# Altium schematic sheet nusense-controller.schdoc: NUSense
size A4; Organization: Elby Designs; Address1: 9 Follan Close; Address2: Kariong; Address3: NSW 2250; Address4: Australia; Revision: 1; SheetNumber: 1; SheetTotal: 9; DrawnBy: Controller Section; Engineer: Laurie Biddulph; PageSetup: Record=PageOptions|CenterHorizontal=True|CenterVertical=True|PrintScale=1.38|XCorrection=1.00|YCorrection=1.00|PrintKind=1|BorderSize=5000000|LeftOffset=0|BottomOffset=0|Orientation=2|PaperLength=1000|PaperWidth=1000|Scale=100|PaperSource=7|PrintQuality=-4|MediaType=1|DitherType=10|PaperKind=A3|PrintScaleMode=1
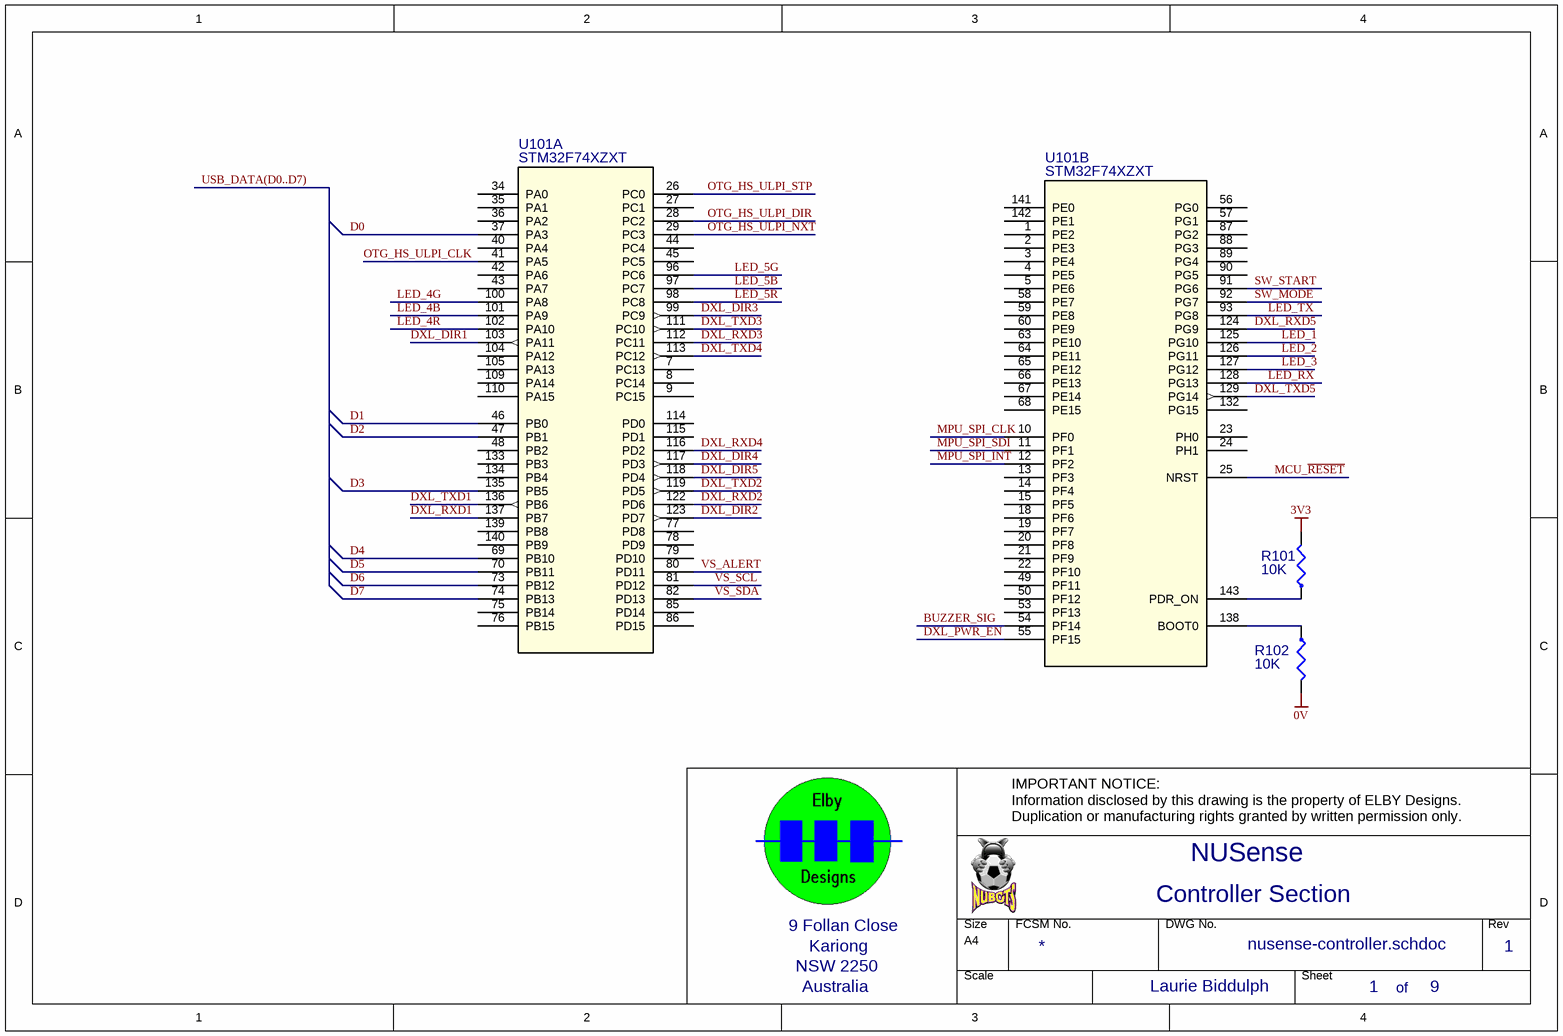
[diagram p0: nusense-controller.schdoc]

## Parts
R101  10K  [AXIAL-0.4(LB)]
R102  10K  [AXIAL-0.4(LB)]
U101  STM32F74XZXT  [LQFP-144_20X20mm]  (parts A,B of 3)

## Nets
0V: R102.2
3V3: R101.2
BUZZER_SIG: U101.54(PF14)
D0: U101.37(PA3)
D1: U101.46(PB0)
D2: U101.47(PB1)
D3: U101.135(PB5)
D4: U101.69(PB10)
D5: U101.70(PB11)
D6: U101.73(PB12)
D7: U101.74(PB13)
DXL_DIR1: U101.103(PA11)
DXL_DIR2: U101.123(PD7)
DXL_DIR3: U101.99(PC9)
DXL_DIR4: U101.117(PD3)
DXL_DIR5: U101.118(PD4)
DXL_PWR_EN: U101.55(PF15)
DXL_RXD1: U101.137(PB7)
DXL_RXD2: U101.122(PD6)
DXL_RXD3: U101.112(PC11)
DXL_RXD4: U101.116(PD2)
DXL_RXD5: U101.124(PG9)
DXL_TXD1: U101.136(PB6)
DXL_TXD2: U101.119(PD5)
DXL_TXD3: U101.111(PC10)
DXL_TXD4: U101.113(PC12)
DXL_TXD5: U101.129(PG14)
LED_1: U101.125(PG10)
LED_2: U101.126(PG11)
LED_3: U101.127(PG12)
LED_4B: U101.101(PA9)
LED_4G: U101.100(PA8)
LED_4R: U101.102(PA10)
LED_5B: U101.97(PC7)
LED_5G: U101.96(PC6)
LED_5R: U101.98(PC8)
LED_RX: U101.128(PG13)
LED_TX: U101.93(PG8)
MCU_~{RESET}: U101.25(NRST)
MPU_SPI_CLK: U101.10(PF0)
MPU_SPI_INT: U101.12(PF2)
MPU_SPI_SDI: U101.11(PF1)
OTG_HS_ULPI_CLK: U101.41(PA5)
OTG_HS_ULPI_DIR: U101.28(PC2)
OTG_HS_ULPI_NXT: U101.29(PC3)
OTG_HS_ULPI_STP: U101.26(PC0)
SW_MODE: U101.92(PG7)
SW_START: U101.91(PG6)
VS_ALERT: U101.80(PD11)
VS_SCL: U101.81(PD12)
VS_SDA: U101.82(PD13)
NetR101_1: R101.1 U101.143(PDR_ON)
NetR102_1: R102.1 U101.138(BOOT0)

Not connected (* = marked no-connect by the designer): U101 1(PE2) 2(PE3) 3(PE4) 4(PE5) 5(PE6) 7(PC13) 8(PC14) 9(PC15) 13(PF3) 14(PF4) 15(PF5) 18(PF6) 19(PF7) 20(PF8) 21(PF9) 22(PF10) 23(PH0) 24(PH1) 27(PC1) 34(PA0) 35(PA1) 36(PA2) 40(PA4) 42(PA6) 43(PA7) 44(PC4) 45(PC5) 48(PB2) 49(PF11) 50(PF12) 53(PF13) 56(PG0) 57(PG1) 58(PE7) 59(PE8) 60(PE9) 63(PE10) 64(PE11) 65(PE12) 66(PE13) 67(PE14) 68(PE15) 75(PB14) 76(PB15) 77(PD8) 78(PD9) 79(PD10) 85(PD14) 86(PD15) 87(PG2) 88(PG3) 89(PG4) 90(PG5) 104(PA12) 105(PA13) 109(PA14) 110(PA15) 114(PD0) 115(PD1) 132(PG15) 133(PB3) 134(PB4) 139(PB8) 140(PB9) 141(PE0) 142(PE1)

## Buses and harness runs
bus USB_DATA(D0..D7)

## Notes on the sheet
- IMPORTANT NOTICE:
  Information disclosed by this drawing is the property of ELBY Designs.
  Duplication or manufacturing rights granted by written permission only.
- of

## Library data of the parts
R101 R102 = RM-10K(LB): 0.5W 1% Metal Film Resistor; EMRP: RM-10K
U101 = STM32F74XZXT: 32-bit Microcontroller; Vendor: STMicroelectronics; C: Copyright (C) 2016 Accelerated Designs. All rights reserved; Manufacturer_Part_Number: stm32f74xzxt; Copyright: Copyright (C) 2016 Accelerated Designs. All rights reserved; Value: Value; Type: Type; RefDes: RefDes